# Altium schematic sheet nanoDAP.SchDoc
size A4
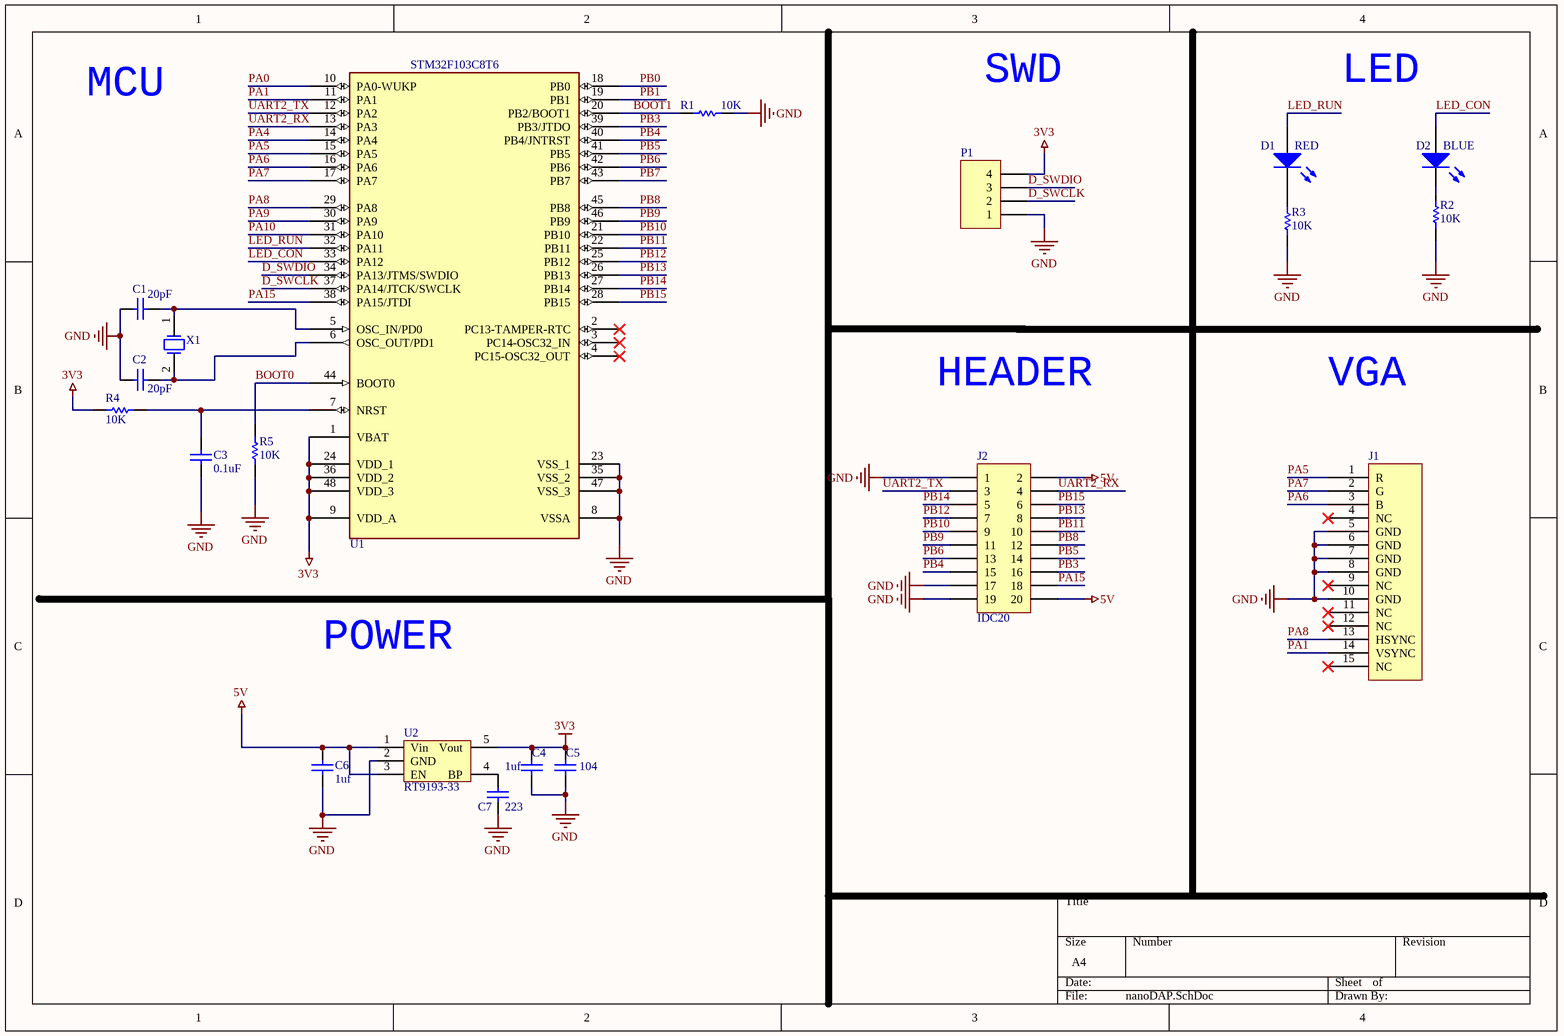
[diagram p0: nanoDAP.SchDoc]

## Parts
C1  value 20pF  [0603_C]  (hidden comment: C0603)
C2  value 20pF  [0603_C]  (hidden comment: C0603)
C3  value 0.1uF  [0603_C]  (hidden comment: C0603)
C4  1uf  [0603_C]
C5  104  [0603_C]
C6  1uf  [0603_C]
C7  223  [0603_C]
D1  RED  [0603_LED]
D2  BLUE  [0603_LED]
J1  VGA_FEMALE  [VGA15B]  (value not drawn)
J2  IDC20  [IDC20]
P1  Header 4  [HEADER_4x1]  (value not drawn)
R1  value 10K  [0603_R]  (hidden comment: R0603)
R2  value 10K  [0603_R]  (hidden comment: R0603)
R3  value 10K  [0603_R]  (hidden comment: R0603)
R4  value 10K  [0603_R]  (hidden comment: R0603)
R5  value 10K  [0603_R]  (hidden comment: R0603)
U1  STM32F103C8T6  [LQFP48_N]
U2  RT9193-33  [SOT23-5]
X1  XTAL  [49SMD]  (value not drawn)

## Nets
3V3: C4.2 C5.2 P1.4 R4.2 U1.1(VBAT) U1.9(VDD_A) U1.24(VDD_1) U1.36(VDD_2) U1.48(VDD_3) U2.5(Vout)
5V: C6.2 J2.2 J2.20 U2.1(Vin) U2.3(EN)
GND: C1.2 C2.2 C3.1 C4.1 C5.1 C6.1 C7.1 J1.5(GND) J1.6(GND) J1.7(GND) J1.8(GND) J1.10(GND) J2.1 J2.17 J2.19 P1.1 R1.1 R2.1 R3.1 R5.2 U1.8(VSSA) U1.23(VSS_1) U1.35(VSS_2) U1.47(VSS_3) U2.2(GND)
BOOT0: R5.1 U1.44(BOOT0)
BOOT1: R1.2 U1.20(PB2/BOOT1)
D_SWCLK: P1.2 U1.37(PA14/JTCK/SWCLK)
D_SWDIO: P1.3 U1.34(PA13/JTMS/SWDIO)
LED_CON: D2.1(A) U1.33(PA12)
LED_RUN: D1.1(A) U1.32(PA11)
PA0: U1.10(PA0-WUKP)
PA1: J1.14(VSYNC) U1.11(PA1)
PA4: U1.14(PA4)
PA5: J1.1(R) U1.15(PA5)
PA6: J1.3(B) U1.16(PA6)
PA7: J1.2(G) U1.17(PA7)
PA8: J1.13(HSYNC) U1.29(PA8)
PA9: U1.30(PA9)
PA10: U1.31(PA10)
PA15: J2.18 U1.38(PA15/JTDI)
PB0: U1.18(PB0)
PB1: U1.19(PB1)
PB3: J2.16 U1.39(PB3/JTDO)
PB4: J2.15 U1.40(PB4/JNTRST)
PB5: J2.14 U1.41(PB5)
PB6: J2.13 U1.42(PB6)
PB7: U1.43(PB7)
PB8: J2.12 U1.45(PB8)
PB9: J2.11 U1.46(PB9)
PB10: J2.9 U1.21(PB10)
PB11: J2.10 U1.22(PB11)
PB12: J2.7 U1.25(PB12)
PB13: J2.8 U1.26(PB13)
PB14: J2.5 U1.27(PB14)
PB15: J2.6 U1.28(PB15)
UART2_RX: J2.4 U1.13(PA3)
UART2_TX: J2.3 U1.12(PA2)
NetC1_1: C1.1 U1.5(OSC_IN/PD0) X1.1
NetC2_1: C2.1 U1.6(OSC_OUT/PD1) X1.2
NetC3_2: C3.2 R4.1 U1.7(NRST)
NetC7_2: C7.2 U2.4(BP)
NetD1_2: D1.2(K) R3.2
NetD2_2: D2.2(K) R2.2

Not connected (* = marked no-connect by the designer): J1 4(NC)* 9(NC)* 11(NC)* 12(NC)* 15(NC)*; U1 2(PC13-TAMPER-RTC)* 3(PC14-OSC32_IN)* 4(PC15-OSC32_OUT)*

## Notes on the sheet
- MCU
- SWD
- LED
- HEADER
- VGA
- POWER

## Library data of the parts
C1-C3 = C0603: Capacitor; Published: 8-Jun-2000; LatestRevisionDate: 17-Jul-2002; LatestRevisionNote: Re-released for DXP Platform.; PackageReference: RAD-0.3; Publisher: Altium Limited; PackageDescription: Radial Cap, Thru-Hole; 2 Leads; 0.3 in Pin Spacing
C4 C6 C7 = CAP: Capacitor
  C4 C6: value: 1uF
  C7: value: 223
C5 = CAP: Capacitor; value: 0.1uF
D1 D2 = D0603: Typical RED, GREEN, YELLOW, AMBER GaAs LED; Published: 8-Jun-2000; LatestRevisionDate: 17-Jul-2002; LatestRevisionNote: Re-released for DXP Platform.; PackageVersion: Feb-2002; PackageReference: 3.2X1.6X1.1; Publisher: Altium Limited; PackageDescription: SM LED; 2 Flat Leads
P1 = Header 4: Header, 4-Pin; LatestRevisionDate: 17-Jul-2002; LatestRevisionNote: Re-released for DXP Platform.; Publisher: Altium Limited
R1-R5 = R0603: Resistor; Published: 8-Jun-2000; LatestRevisionDate: 17-Jul-2002; LatestRevisionNote: Re-released for DXP Platform.; PackageReference: AXIAL-0.3; Publisher: Altium Limited; PackageDescription: Axial Device, Thru-Hole; 2 Leads; 0.3 in Pin Spacing
U1 = STM32F103C8T6: LowPower MCU
X1 = XTAL: value: 8MHz